# EAGLE design DorMouse (EAGLE 6.3)
DorMouse rocket flight-computer Schematic
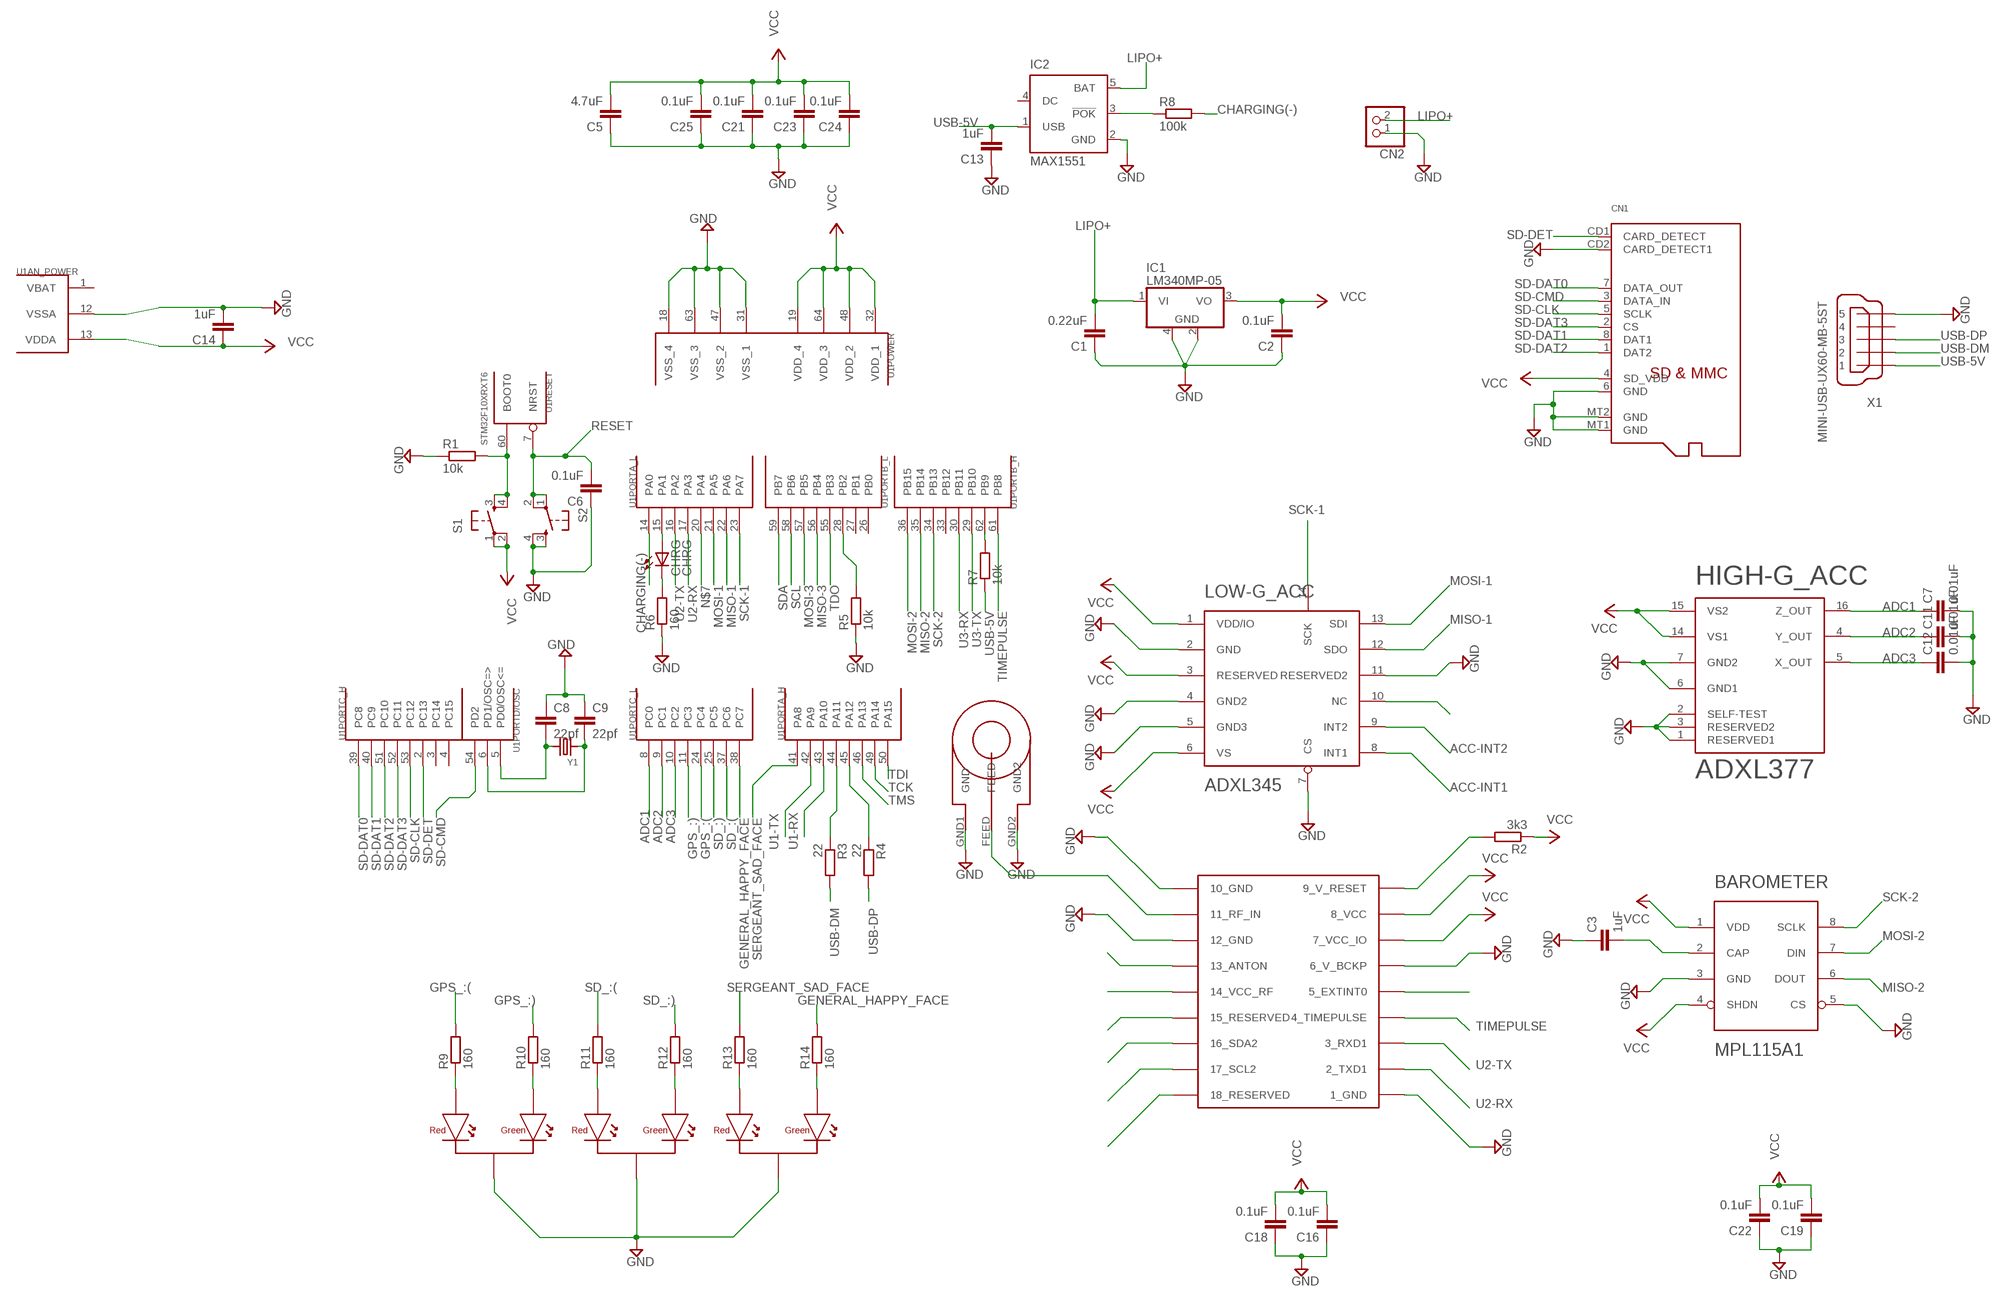
[diagram p0: schematic, sheet 1, part 1 of 2]
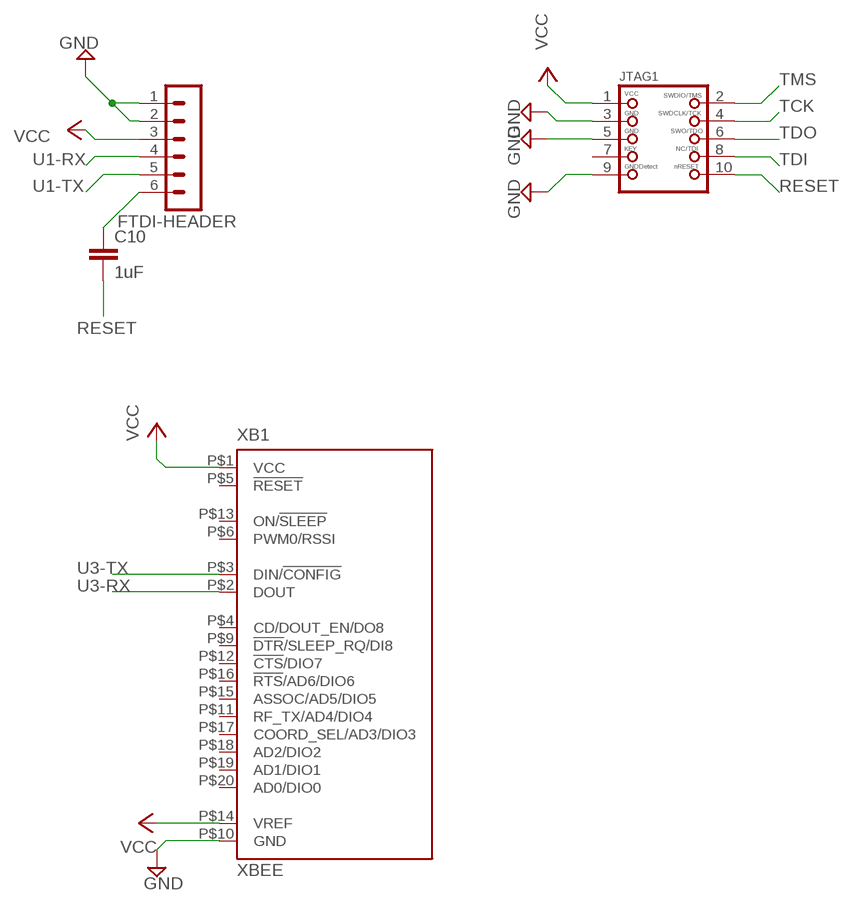
[diagram p1: schematic, sheet 1, part 2 of 2]

## Parts
BAROMETER  MPL115A1  [LGA-8]
C1  0.22uF  C-EUC0402  [C0402]
C2  0.1uF  C-EUC0402  [C0402]
C3  1uF  C-EUC0402  [C0402]
C5  4.7uF  C-EUC0402  [C0402]
C6  0.1uF  C-EUC0402  [C0402]
C7  0.01uF  C-EUC0402  [C0402]
C8  22pf  C-EUC0402  [C0402]
C9  22pf  C-EUC0402  [C0402]
C10  1uF  C-EUC0402  [C0402]
C11  0.01uF  C-EUC0402  [C0402]
C12  0.01uF  C-EUC0402  [C0402]
C13  1uF  C-EUC0402  [C0402]
C14  1uF  C-EUC0402  [C0402]
C16  0.1uF  C-EUC0402  [C0402]
C18  0.1uF  C-EUC0402  [C0402]
C19  0.1uF  C-EUC0402  [C0402]
C21  0.1uF  C-EUC0402  [C0402]
C22  0.1uF  C-EUC0402  [C0402]
C23  0.1uF  C-EUC0402  [C0402]
C24  0.1uF  C-EUC0402  [C0402]
C25  0.1uF  C-EUC0402  [C0402]
CHRG  CHRG  LEDCHIPLED_0603  [CHIPLED_0603]
CN1  MICROSD  [MICROSD]
CN2  JST_2PINSH2  [JSTSH2]
FTDI-HEADER  MA06-1  [MA06-1]
GENERAL  Status  RED-GREEN_LED  [SOT23]
GPS  UBLOX_MAX-6  [UBLOX_MAX-6]
GPS-LED  GPS  RED-GREEN_LED  [SOT23]
HIGH-G_ACC  ADXL377  [LFCSP-16]
IC1  LM340MP-05  [SOT223]
IC2  MAX1551  [SOT23-5L]
JTAG1  JTAG-CORTEXM3  [2X05_1.27MM_SMT]
LOW-G_ACC  ADXL345  [LGA-14]
R1  10k  R-EU_R0402  [R0402]
R2  3k3  R-EU_R0402  [R0402]
R3  22  R-EU_R0402  [R0402]
R4  22  R-EU_R0402  [R0402]
R5  10k  R-EU_R0402  [R0402]
R6  160  R-EU_R0402  [R0402]
R7  10k  R-EU_R0402  [R0402]
R8  100k  R-EU_R0402  [R0402]
R9  160  R-EU_R0402  [R0402]
R10  160  R-EU_R0402  [R0402]
R11  160  R-EU_R0402  [R0402]
R12  160  R-EU_R0402  [R0402]
R13  160  R-EU_R0402  [R0402]
R14  160  R-EU_R0402  [R0402]
S1  TAC_SWITCHSMD  [TACTILE_SWITCH_SMD]
S2  TAC_SWITCHSMD  [TACTILE_SWITCH_SMD]
SD-LED  SD-C  RED-GREEN_LED  [SOT23]
U1  STM32F10XRXT6  [TQFP64]
U$1  SARANTEL-SR1202  [SARANTEL-SR1202]
X1  MINI-USB-UX60-MB-5ST  [UX60-MB-5ST]
XB1  XBEE  [XBEE]
Y1  CRYSTALSMD  [HC49UP]

## Nets
ACC-INT1: LOW-G_ACC.8(INT1)
ACC-INT2: LOW-G_ACC.9(INT2)
ADC1: C7.1 HIGH-G_ACC.16(Z_OUT) U1.8(PORTC_L:PC0)
ADC2: C11.1 HIGH-G_ACC.4(Y_OUT) U1.9(PORTC_L:PC1)
ADC3: C12.1 HIGH-G_ACC.5(X_OUT) U1.10(PORTC_L:PC2)
BOOT1: R5.2 U1.28(PORTB_L:PB2)
CHARGING(-): R8.2 U1.14(PORTA_L:PA0)
GENERAL_HAPPY_FACE: R14.2 U1.38(PORTC_L:PC7)
GND: BAROMETER.3(GND) BAROMETER.5(CS) C1.1 C2.1 C3.1 C5.1 C6.1 C7.2 C8.1 C9.1 C11.2 C12.2 C13.1 C14.2 C16.1 C18.1 C19.1 C21.1 C22.1 C23.1 C24.1 C25.1 CN1.6(GND) CN1.CD2(CARD_DETECT1) CN1.MT1(GND) CN1.MT2(GND) CN2.1 FTDI-HEADER.1 FTDI-HEADER.2 GENERAL.3(CATHODE) GPS-LED.3(CATHODE) GPS.1_GND GPS.6_V_BCKP GPS.10_GND GPS.12_GND HIGH-G_ACC.1(RESERVED1) HIGH-G_ACC.2(SELF-TEST) HIGH-G_ACC.3(RESERVED2) HIGH-G_ACC.6(GND1) HIGH-G_ACC.7(GND2) IC1.2(GND1) IC1.4(GND) IC2.2(GND) JTAG1.3 JTAG1.5 JTAG1.9 LOW-G_ACC.2(GND) LOW-G_ACC.4(GND2) LOW-G_ACC.5(GND3) LOW-G_ACC.7(CS) LOW-G_ACC.11(RESERVED2) R1.1 R5.1 R6.1 S2.3 S2.4 SD-LED.3(CATHODE) U1.12(AN_POWER:VSSA) U1.18(POWER:VSS_4) U1.31(POWER:VSS_1) U1.47(POWER:VSS_2) U1.63(POWER:VSS_3) U$1.GND1(GND) U$1.GND2 X1.5 XB1.P$10(GND)
GPS_:(: R9.2 U1.24(PORTC_L:PC4)
GPS_:): R10.2 U1.11(PORTC_L:PC3)
LIPO+: C1.2 CN2.2 IC1.1(VI) IC2.5(BAT)
MISO-1: LOW-G_ACC.12(SDO) U1.22(PORTA_L:PA6)
MISO-2: BAROMETER.6(DOUT) U1.35(PORTB_H:PB14)
MISO-3: U1.56(PORTB_L:PB4)
MOSI-1: LOW-G_ACC.13(SDI) U1.21(PORTA_L:PA5)
MOSI-2: BAROMETER.7(DIN) U1.36(PORTB_H:PB15)
MOSI-3: U1.57(PORTB_L:PB5)
N$1: GPS.16_SDA2
N$2: R1.2 S1.3 S1.4 U1.60(RESET:BOOT0)
N$3: BAROMETER.2(CAP) C3.2
N$4: GPS.5_EXTINT0
N$5: R3.1 U1.44(PORTA_H:PA11)
N$6: C9.2 U1.6(PORTD/OSC:PD1/OSC=>) Y1.1
N$7: U1.20(PORTA_L:PA4)
N$8: R4.1 U1.45(PORTA_H:PA12)
N$9: CHRG.A U1.15(PORTA_L:PA1)
N$10: GPS.17_SCL2
N$11: LOW-G_ACC.10(NC)
N$12: CHRG.C R6.2
N$13: IC2.3(!POK) R8.1
N$14: C8.2 U1.5(PORTD/OSC:PD0/OSC<=) Y1.2
N$15: GPS.9_V_RESET R2.2
N$16: GPS.13_ANTON
N$17: GPS-LED.1(RED-ANODE) R9.1
N$18: GPS.11_RF_IN U$1.FEED
N$19: C10.1 FTDI-HEADER.6
N$20: GPS.15_RESERVED
N$21: R7.2 U1.62(PORTB_H:PB9)
N$23: GPS.18_RESERVED
N$24: GPS.14_VCC_RF
N$27: GPS-LED.2(GREEN-ANODE) R10.1
N$30: R11.1 SD-LED.1(RED-ANODE)
N$31: R12.1 SD-LED.2(GREEN-ANODE)
N$33: GENERAL.1(RED-ANODE) R13.1
N$34: GENERAL.2(GREEN-ANODE) R14.1
RESET: C6.2 C10.2 JTAG1.10 S2.1 S2.2 U1.7(RESET:NRST)
SCK-1: LOW-G_ACC.14(SCK) U1.23(PORTA_L:PA7)
SCK-2: BAROMETER.8(SCLK) U1.34(PORTB_H:PB13)
SCL: U1.58(PORTB_L:PB6)
SD-CLK: CN1.5(SCLK) U1.53(PORTC_H:PC12)
SD-CMD: CN1.3(DATA_IN) U1.54(PORTD/OSC:PD2)
SD-DAT0: CN1.7(DATA_OUT) U1.39(PORTC_H:PC8)
SD-DAT1: CN1.8(DAT1) U1.40(PORTC_H:PC9)
SD-DAT2: CN1.1(DAT2) U1.51(PORTC_H:PC10)
SD-DAT3: CN1.2(CS) U1.52(PORTC_H:PC11)
SD-DET: CN1.CD1(CARD_DETECT) U1.2(PORTC_H:PC13)
SD_:(: R11.2 U1.37(PORTC_L:PC6)
SD_:): R12.2 U1.25(PORTC_L:PC5)
SDA: U1.59(PORTB_L:PB7)
SERGEANT_SAD_FACE: R13.2 U1.41(PORTA_H:PA8)
TCK: JTAG1.4 U1.49(PORTA_H:PA14)
TDI: JTAG1.8 U1.50(PORTA_H:PA15)
TDO: JTAG1.6 U1.55(PORTB_L:PB3)
TIMEPULSE: GPS.4_TIMEPULSE U1.61(PORTB_H:PB8)
TMS: JTAG1.2 U1.46(PORTA_H:PA13)
U1-RX: FTDI-HEADER.4 U1.43(PORTA_H:PA10)
U1-TX: FTDI-HEADER.5 U1.42(PORTA_H:PA9)
U2-RX: GPS.2_TXD1 U1.17(PORTA_L:PA3)
U2-TX: GPS.3_RXD1 U1.16(PORTA_L:PA2)
U3-RX: U1.30(PORTB_H:PB11) XB1.P$2(DOUT)
U3-TX: U1.29(PORTB_H:PB10) XB1.P$3(DIN/!CONFIG)
USB-5V: C13.2 IC2.1(USB) R7.1 X1.1
USB-DM: R3.2 X1.2
USB-DP: R4.2 X1.3
VCC: BAROMETER.1(VDD) BAROMETER.4(SHDN) C2.2 C5.2 C14.1 C16.2 C18.2 C19.2 C21.2 C22.2 C23.2 C24.2 C25.2 CN1.4(SD_VDD) FTDI-HEADER.3 GPS.7_VCC_IO GPS.8_VCC HIGH-G_ACC.14(VS1) HIGH-G_ACC.15(VS2) IC1.3(VO) JTAG1.1 LOW-G_ACC.1(VDD/IO) LOW-G_ACC.3(RESERVED) LOW-G_ACC.6(VS) R2.1 S1.1 S1.2 U1.13(AN_POWER:VDDA) U1.19(POWER:VDD_4) U1.32(POWER:VDD_1) U1.48(POWER:VDD_2) U1.64(POWER:VDD_3) XB1.P$1(VCC) XB1.P$14(VREF)
Unconnected: IC2.4(DC) JTAG1.7 U1.3(PORTC_H:PC14) U1.4(PORTC_H:PC15) U1.26(PORTB_L:PB0) U1.27(PORTB_L:PB1) U1.33(PORTB_H:PB12) X1.4 XB1.P$4(CD/DOUT_EN/DO8) XB1.P$5(!RESET) XB1.P$6(PWM0/RSSI) XB1.P$9(!DTR!/SLEEP_RQ/DI8) XB1.P$11(RF_TX/AD4/DIO4) XB1.P$12(!CTS!/DIO7) XB1.P$13(ON/!SLEEP) XB1.P$15(ASSOC/AD5/DIO5) XB1.P$16(!RTS!/AD6/DIO6) XB1.P$17(COORD_SEL/AD3/DIO3) XB1.P$18(AD2/DIO2) XB1.P$19(AD1/DIO1) XB1.P$20(AD0/DIO0)

## Power pins joined to a net without a drawn wire
VBAT: U1.1(AN_POWER:VBAT)

## Library data of the parts
BAROMETER = DorMouse:MPL115A1
C1-C3 C5-C14 C16 C18 C19 C21-C25 = rcl:C-EU: CAPACITOR, European symbol
CHRG = led:LED: LED OSRAM: - CHIPLED LG R971, LG N971, LY N971, LG Q971, LY Q971, LO R971, LY R971 LH N974, LH R974 LS Q976, LO Q976, LY Q976 LO Q996 - Hyper CHIPLED LW Q18S LB Q993, LB Q99A, LB R99A - SideLED LS A670, LO A670, LY A670, LG A670, LP A670 LB A673, LV A673, LT A673, LW A673 LH A674 LY A675 LS A676, LA A676, LO A676, LY A676, LW A676 LS A679, LY A679, LG A679 - Hyper Micro SIDELED® LS Y876, LA Y876, LO Y876, LY Y876 LT Y87S - SmartLED LW L88C, LW L88S LB L89C, LB L89S, LG L890 LS L89K, LO L89K, LY L89K LS L896, LA L896, LO L896, LY L896 - TOPLED LS T670, LO T670, LY T670, LG T670, LP T670 LSG T670, LSP T670, LSY T670, LOP T670, LYG T670 LG T671, LOG T671, LSG T671 LB T673, LV T673, LT T673, LW T673 LH T674 LS T676, LA T676, LO T676, LY T676, LB T676, LH T676, LSB T676, LW T676 LB T67C, LV T67C, LT T67C, LS T67K, LO T67K, LY T67K, LW E67C LS E67B, LA E67B, LO E67B, LY E67B, LB E67C, LV E67C, LT E67C LW T67C LS T679, LY T679, LG T679 LS T770, LO T770, LY T770, LG T770, LP T770 LB T773, LV T773, LT T773, LW T773 LH T774 LS E675, LA E675, LY E675, LS T675 LS T776, LA T776, LO T776, LY T776, LB T776 LHGB T686 LT T68C, LB T68C - Hyper Mini TOPLED® LB M676 - Mini TOPLED Santana® LG M470 LS M47K, LO M47K, LY M47K Source: http://www.osram.convergy.de LUXEON: - LUMILED® LXK2-PW12-R00, LXK2-PW12-S00, LXK2-PW14-U00, LXK2-PW14-V00 LXK2-PM12-R00, LXK2-PM12-S00, LXK2-PM14-U00 LXK2-PE12-Q00, LXK2-PE12-R00, LXK2-PE12-S00, LXK2-PE14-T00, LXK2-PE14-U00 LXK2-PB12-K00, LXK2-PB12-L00, LXK2-PB12-M00, LXK2-PB14-N00, LXK2-PB14-P00, LXK2-PB14-Q00 LXK2-PR12-L00, LXK2-PR12-M00, LXK2-PR14-Q00, LXK2-PR14-R00 LXK2-PD12-Q00, LXK2-PD12-R00, LXK2-PD12-S00 LXK2-PH12-R00, LXK2-PH12-S00 LXK2-PL12-P00, LXK2-PL12-Q00, LXK2-PL12-R00 Source: www.luxeon.com KINGBRIGHT: KA-3528ASYC Source: www.kingbright.com
CN1 = microbuilder:MICROSD: MicroSD/Transflash Card Holder with SPI pinout 3M: 2908-05WB-MG 4UConnector: 19656 Footprint courtesy: Adafruit Industries
CN2 = microbuilder:JST_2PIN: JST 2-Pin Right-Angle Connector PH-Series - 4UConnector: 17311 SH-Series - 4UConnector: 07278
FTDI-HEADER = con-lstb:MA06-1: PIN HEADER; OC_FARNELL: unknown; OC_NEWARK: unknown
GENERAL GPS-LED SD-LED = DorMouse:RED-GREEN_LED
GPS = Ava:UBLOX_MAX-6: UBLOX MAX-6
HIGH-G_ACC = DorMouse:ADXL377
IC1 = DorMouse:LM340?-*: Positive VOLTAGE REGULATOR Source: http://cache.national.com/ds/LM/LM340.pdf
IC2 = maxim:MAX1551: Dual-Input USB/AC Adapter 1-Cell Li+ Battery Chargers Source: http://www.maxim-ic.com .. MAX1551-MAX1555.pdf; MF: MAXIM; MPN: MAX1551EZK-T; OC_FARNELL: 1628221; OC_NEWARK: 88H0599
JTAG1 = microbuilder:JTAG-CORTEXM3: Serial Wire (SW-DP) Connector This standard 0.05" 10-pin connector is for use with the Cortex M0/M3's native SWD (serial wire debugger) interface (SW-DP). Some boards support a 20-pin combined JTAG+SWD connector (SWJ-DP), such as the LPC1700 family, but many smaller devices only work with SWD which typically use the smaller 10-pin SW-DP connecter (the LPC1300 family, for example, only supports SWD). 2x05 1.27mm/0.05" Connector: This is the standard SMT connector defined by ARM for all Cortex devices, and should be used in most situations and for forward-compatibility since any new devices coming to market will likely use this connector. MOLEX 10 Pin 0.1" Connector: This 0.1" 10 pin connector has the same pin layout as the standard 0.05" connector, but is easier to work with if you are using standard jumper wires or custom cables to connect your SWD hardware. MOLEX 20 Pin 0.1" Connector: This 0.1" 20 pin connector is the same model used for ARM7/ARM9 JTAG debuggers, but is connected to match the pins on the Segger J-Link for ARM (which supports both JTAG and SWD debugging). See the following document from ARM for more information on Cortex M3 Debug Connectors: http://infocenter.arm.com/help/topic/com.arm.doc.faqs/attached/13634/cortex_debug_connectors.pdf And the following page for an overview with images of the different connector types: http://www.keil.com/peripherals/coresight/connectors.asp
LOW-G_ACC = Swallow:ADXL345
R1-R14 = rcl:R-EU_: RESISTOR, European symbol
S1 S2 = SparkFun:TAC_SWITCH: Momentary Switch Button commonly used for reset or general input. Spark Fun Electronics SKU : COM-00097
U1 = stm32:STM32F10XRXT6: STM32F101/103 64pin LQFP
U$1 = Ava:SARANTEL-SR1202: SARANTEL-SL1202 Author Anthony Stirk / http://ava.upuaut.net Data Sheet : http://docs-europe.electrocomponents.com/webdocs/0dbd/0900766b80dbde80.pdf
X1 = con-hirose:MINI-USB-: MINI USB Connector Source: http://www.hirose.co.jp/cataloge_hp/e24000019.pdf; OC_FARNELL: unknown; OC_NEWARK: unknown
XB1 = Swallow:XBEE: XBee (TM) /XBee-PRO(TM) OEM RF Modules Source: MaxStream, Inc. xbee_productmanual.pdf; MPN: XBP24-Z7UIT-004; OC_FARNELL: 1751799; OC_NEWARK: 34R5507
Y1 = microbuilder:CRYSTAL: Crystals HC49UP - Surface Mount Crystal 4.0MHz 18pF +/-30ppm Surface Mount Crystal [Digikey: 535-9857-1-ND] 12.0 MHz Surface Mount Crystal [Digikey: 535-9869-6-ND] 25.0 MHz Surface Mount Crystal [Digikey: 535-9078-1-ND] 2.5 x 2.0mm - MEMs SMT Crystal 16.0 MHz 10pF 20ppm 2.5 x 2.0mm Crystal [Digikey -40-85°C: 535-10923-1-ND] 3.2 x 2.5mm - MEMs SMT Crystal 12.0 MHz 8pF 15ppm 3.2 x 2.5mm Crystal [Digikey: -10-70°C: 644-1047-1-ND -40-125°C: 644-1128-1-ND] 16.0 MHz 8pF 15ppm 3.2 x 2.5mm Crystal [Digikey: -10-70°C: 644-1049-1-ND -40-125°C: 644-1129-2-ND] 16.0 MHz 10pF 10ppm 3.2 x 2.5mm Crystal [Digikey: 644-1100-1-ND] 27.12 MHz 18pF 30ppm 3.2 x 2.5mm Crystal [Digikey: 887-1424-1-ND] 27.12MHz 10pF 10ppm 3.2 x 2.5mm Crystal [Digikey: 887-1329-1-ND] 4.9 x 1.8mm - MEMs SMT Crystal 32.768 KHz 12.5pF 20ppm 4.9 x 1.8mm Crystal [Digikey: SE2415CT-ND] 8.0 x 3.8mm - Surface Mount Crystal 32.768kHz 12.5pF 20ppm -40°C-85°C [Digikey: 535-9166-2-ND] Cylinder 32.768KHz Cylinder Crystal (2x6mm body) [Ex. Digikey: 300-8341-2-ND]

## Board
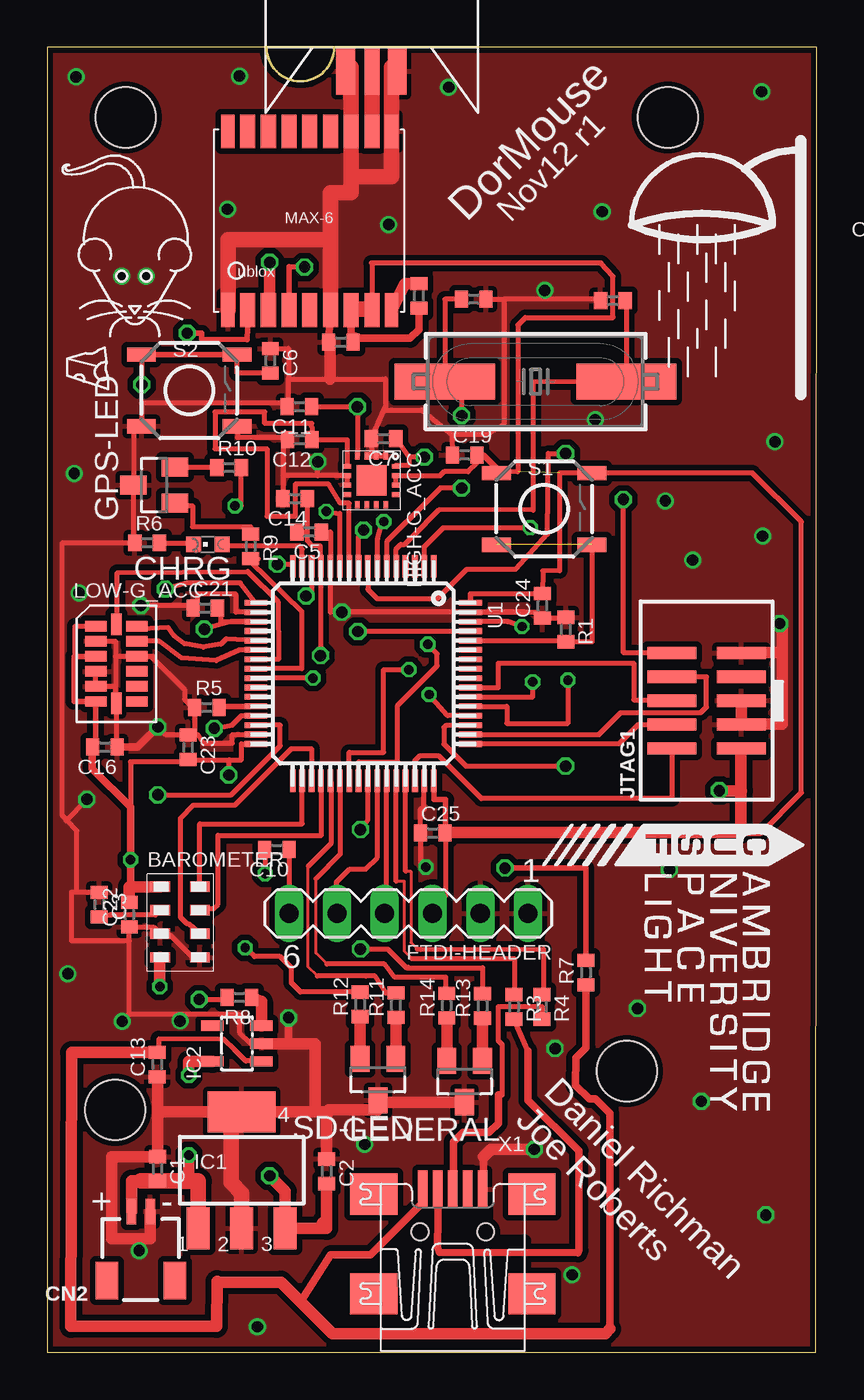
[diagram p2: board, top side]
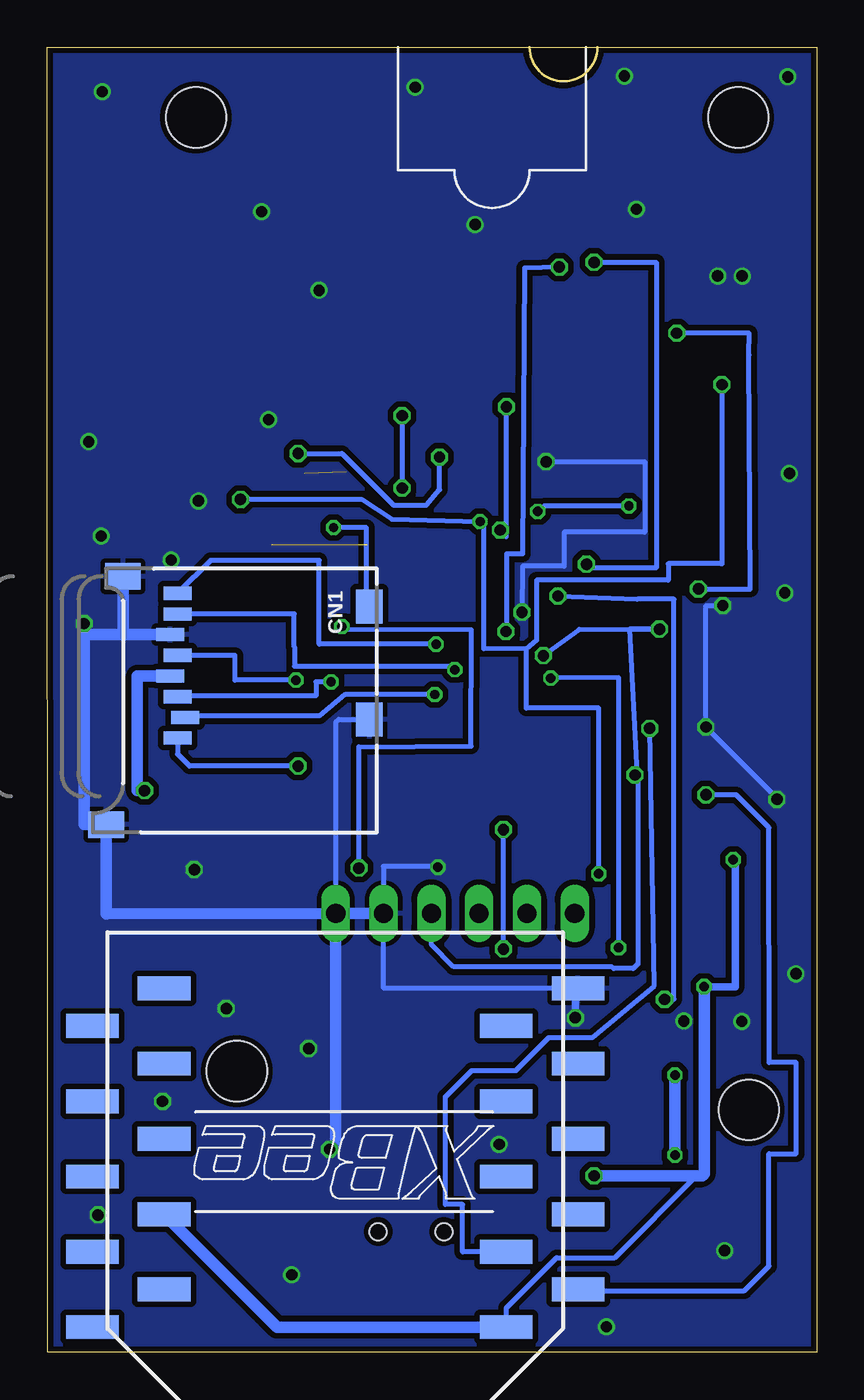
[diagram p3: board, bottom side, seen from below]

Size 40.92 x 69.38 mm. Coordinates in mm from the lower left corner, seen from the top.
Outline: 0,0 40.87,0 40.92,69.38 0,69.38 0,0
Copper layers (1*16): Top 0.035mm / dielectric 1.5mm / Bottom 0.035mm
Design rules "Fusion_eagle_rule_v1.1": minimum track width 6mil, minimum drill 12mil, track to track 6mil, track to pad 6mil, pad to pad 6mil, via to via 6mil, smd to smd 0mil, copper to edge 10mil, drill to drill 10mil, minimum pad ring 10mil, minimum via ring 6mil, stop-mask expansion 2mil, vias tented up to drill 100mil, thermal gap 10mil
Holes 3.2 mm at 33,65.64 4.18,65.64 3.62,12.89 30.83,14.95

### Footprints (pad centres in the part's own frame; a part is rotated, then mirrored left to right if it is on the bottom)
LGA-8 = smd 1.05 x 0.55: 1 0.35,4; 2 0.35,2.75; 3 0.35,1.5; 4 0.35,0.25; 5 2.45,0.25; 6 2.45,1.5; 7 2.45,2.75; 8 2.45,4
C0402 = smd 0.7 x 0.9: 1 -0.65,0; 2 0.65,0
CHIPLED_0603 = smd 0.8 x 0.8: A 0,-0.75; C 0,0.75
MICROSD = smd 0.7 x 1.5: 1 9,-10.64; 2 7.9,-10.24; 3 6.8,-10.64; 4 5.7,-11.04; 5 4.6,-10.64; 6 3.5,-11.04; 7 2.4,-10.64; 8 1.3,-10.64 | smd 1.8 x 1.4: CD1 2,-0.44; CD2 8,-0.44 | smd 1.4 x 1.9: MT1 0.4,-13.54; MT2 13.6,-14.44
JSTSH2 = smd 0.5 x 1.35: 1 -0.5,-2.55; 2 0.5,-2.55 | smd 1.2 x 2: NC1 -1.8,1.125; NC2 1.8,1.125
MA06-1 = drill 1.016 long: 1 -6.35,0; 2 -3.81,0; 3 -1.27,0; 4 1.27,0; 5 3.81,0; 6 6.35,0
SOT23 = smd 1 x 1.4: 1 -0.95,-1.1; 2 0.95,-1.1; 3 0,1.1
UBLOX_MAX-6 = smd 1.8 x 0.7: 1_GND 4.95,-4.4; 9_V_RESET 4.95,4.3; 10_GND -4.55,4.3; 18_RESERVED -4.55,-4.4 | smd 1.8 x 0.8: 2_TXD1 4.95,-3.35; 3_RXD1 4.95,-2.25; 4_TIMEPULSE 4.95,-1.15; 5_EXTINT0 4.95,-0.05; 6_V_BCKP 4.95,1.05; 7_VCC_IO 4.95,2.15; 8_VCC 4.95,3.25; 11_RF_IN -4.55,3.25; 12_GND -4.55,2.15; 13_ANTON -4.55,1.05; 14_VCC_RF -4.55,-0.05; 15_RESERVED -4.55,-1.15; 16_SDA2 -4.55,-2.25; 17_SCL2 -4.55,-3.35
LFCSP-16 = smd 0.4 x 0.25: 1 -1.3,0.75; 2 -1.3,0.25; 3 -1.3,-0.25; 4 -1.3,-0.75; 9 1.3,-0.75; 10 1.3,-0.25; 11 1.3,0.25; 12 1.3,0.75 | smd 0.25 x 0.4: 5 -0.75,-1.3; 6 -0.25,-1.3; 7 0.25,-1.3; 8 0.75,-1.3; 13 0.75,1.3; 14 0.25,1.3; 15 -0.25,1.3; 16 -0.75,1.3 | smd 1.6 x 1.6: NC 0,0
SOT223 = smd 1.219 x 2.235: 1 -2.311,-3.099; 2 0,-3.099; 3 2.311,-3.099 | smd 3.6 x 2.2: 4 0,3.099
SOT23-5L = smd 0.55 x 1.2: 1 -0.95,-1.3; 2 0,-1.3; 3 0.95,-1.3; 4 0.95,1.3; 5 -0.95,1.3
2X05_1.27MM_SMT = smd 0.65 x 2.6: 1 -2.54,-1.85; 2 -2.54,1.85; 3 -1.27,-1.85; 4 -1.27,1.85; 5 0,-1.85; 6 0,1.85; 7 1.27,-1.85; 8 1.27,1.85; 9 2.54,-1.85; 10 2.54,1.85
LGA-14 = smd 1.145 x 0.55: 1 -1.2,1.1; 2 -1.2,0.3; 3 -1.2,-0.5; 4 -1.2,-1.3; 5 -1.2,-2.1; 6 -1.2,-2.9; 8 1,-2.9; 9 1,-2.1; 10 1,-1.3; 11 1,-0.5; 12 1,0.3; 13 0.995,1.1 | smd 0.55 x 1.145: 7 -0.1,-3; 14 -0.1,1.2
R0402 = smd 0.7 x 0.9: 1 -0.65,0; 2 0.65,0
TACTILE_SWITCH_SMD = smd 1.524 x 0.762: 1 -2.54,1.905; 2 2.54,1.905; 3 -2.54,-1.905; 4 2.54,-1.905
TQFP64 = smd 1.2 x 0.3: 1 -5.7,3.75; 2 -5.7,3.25; 3 -5.7,2.75; 4 -5.7,2.25; 5 -5.7,1.75; 6 -5.7,1.25; 7 -5.7,0.75; 8 -5.7,0.25; 9 -5.7,-0.25; 10 -5.7,-0.75; 11 -5.7,-1.25; 12 -5.7,-1.75; 13 -5.7,-2.25; 14 -5.7,-2.75; 15 -5.7,-3.25; 16 -5.7,-3.75; 33 5.7,-3.75; 34 5.7,-3.25; 35 5.7,-2.75; 36 5.7,-2.25; 37 5.7,-1.75; 38 5.7,-1.25; 39 5.7,-0.75; 40 5.7,-0.25; 41 5.7,0.25; 42 5.7,0.75; 43 5.7,1.25; 44 5.7,1.75; 45 5.7,2.25; 46 5.7,2.75; 47 5.7,3.25; 48 5.7,3.75 | smd 0.3 x 1.2: 17 -3.75,-5.7; 18 -3.25,-5.7; 19 -2.75,-5.7; 20 -2.25,-5.7; 21 -1.75,-5.7; 22 -1.25,-5.7; 23 -0.75,-5.7; 24 -0.25,-5.7; 25 0.25,-5.7; 26 0.75,-5.7; 27 1.25,-5.7; 28 1.75,-5.7; 29 2.25,-5.7; 30 2.75,-5.7; 31 3.25,-5.7; 32 3.75,-5.7; 49 3.75,5.7; 50 3.25,5.7; 51 2.75,5.7; 52 2.25,5.7; 53 1.75,5.7; 54 1.25,5.7; 55 0.75,5.7; 56 0.25,5.7; 57 -0.25,5.7; 58 -0.75,5.7; 59 -1.25,5.7; 60 -1.75,5.7; 61 -2.25,5.7; 62 -2.75,5.7; 63 -3.25,5.7; 64 -3.75,5.7
SARANTEL-SR1202 = smd 2.5 x 0.8: FEED 0,0 | smd 2.5 x 1: GND1 0,1.4; GND2 0,-1.35
UX60-MB-5ST = smd 2 x 0.5: 1 2.25,1.6; 2 2.25,0.8; 3 2.25,0; 4 2.25,-0.8; 5 2.25,-1.6 | smd 2.2 x 2.5: M1 -3.3,-4.2; M2 -3.3,4.2; M3 2,4.2; M4 2,-4.2 | hole 0.9: 0,-1.75; 0,1.75
XBEE = smd 2.8 x 1.27: P$1 -9.092,9; P$2 -12.908,7; P$3 -9.092,5; P$4 -12.908,3; P$5 -9.092,1; P$6 -12.908,-1; P$7 -9.092,-3; P$8 -12.908,-5; P$9 -9.092,-7; P$10 -12.908,-9; P$11 12.908,9; P$12 9.092,7; P$13 12.908,5; P$14 9.092,3; P$15 12.908,1; P$16 9.092,-1; P$17 12.908,-3; P$18 9.092,-5; P$19 12.908,-7; P$20 9.092,-9
HC49UP = smd 5.334 x 1.93: 1 -4.826,0; 2 4.826,0

### Placement (x,y rotation side)
BAROMETER  5.67,20.75 0 top
C1  5.88,9.76 270 top
C2  14.87,9.63 270 top
C3  2.78,23.8 270 top
C5  13.93,43.61 180 top
C6  11.87,52.7 270 top
C7  17.89,48.56 180 top
C8  30.08,55.9 0 top
C9  22.68,55.98 180 top
C10  12.21,26.73 180 top
C11  13.41,50.26 180 top
C12  13.43,48.51 180 top
C13  5.86,15.3 90 top
C14  13.19,45.38 180 top
C16  3.08,32.17 180 top
C18  15.62,53.69 0 top
C19  22.2,47.7 0 top
C21  8.41,39.56 0 top
C22  4.38,23.26 90 top
C23  7.5,32.17 270 top
C24  26.33,39.68 90 top
C25  20.51,27.6 0 top
CHRG  8.55,42.95 90 top
CN1  23.34,41.65 270 bottom
CN2  4.99,4.94 180 top
FTDI-HEADER  19.22,23.33 180 top
GENERAL  22.2,14.4 180 top
GPS  14.02,60.34 270 top
GPS-LED  5.7,46.1 90 top
HIGH-G_ACC  17.25,46.35 270 top
IC1  10.35,9.69 0 top
IC2  10.1,16.42 90 top
JTAG1  35.06,34.64 90 top
LOW-G_ACC  3.79,37.5 0 top
R1  27.58,38.42 270 top
R2  19.77,56.16 90 top
R3  24.83,18.37 270 top
R4  26.31,18.37 270 top
R5  8.5,34.28 0 top
R6  5.32,43.03 0 top
R7  28.65,20.19 90 top
R8  10.23,18.87 180 top
R9  10.83,42.84 270 top
R10  9.68,47.03 0 top
R11  18.55,18.46 90 top
R12  16.65,18.5 90 top
R13  23.15,18.42 90 top
R14  21.25,18.44 90 top
S1  26.43,44.83 0 top
S2  7.56,51.13 0 top
SD-LED  17.59,14.5 180 top
U1  16.81,36.09 270 top
U$1  17.27,68.09 90 top
U$2  [SHOWER]  34.56,61.9 0 top
U$3  [DORMOUSE]  4.58,58.23 0 top
U$4  [CUSF_LOGO]  26.26,28.23 270 top
X1  21.57,6.42 90 top
XB1  25.6,10.35 180 bottom
Y1  25.97,51.6 0 top

### Tracks (layer width: path | path; a pad name or v marks a point on that pad's centre or on a via)
ADC1  (via drill 0.6)
  Top 0.254: 17.09,41.79 U1.8 17.06,40.55 17.55,40.06 20.75,40.06 22.32,41.63 24.92,41.63 26.61,43.49 26.65,47.78 v27.57,47.78 | C7.1 19.24,47.6 | 19.24,47.6 19.24,47.14 18.55,47.14 HIGH-G_ACC.16 | v20.06,47.59 19.24,47.6
  Bottom 0.254: v27.57,47.78 25.24,47.78 22.49,45.03 20.76,45.03 20.05,45.85 v20.05,47.59 v20.06,47.59
ADC2  (via drill 0.6)
  Top 0.254: C11.1 v16.5,50.26 HIGH-G_ACC.4 | U1.9 16.55,43.35 v16.83,43.71
  Bottom 0.254: v16.83,43.71 16.5,43.36 v16.5,50.26
ADC3
  Top 0.254: HIGH-G_ACC.5 15.95,48.51 C12.1 14.08,49.19 14.07,49.19 14.07,49.37 11.58,49.37 11.58,49.99 8.92,49.99 8.92,48.03 11.69,48.03 11.69,44.43 13.19,44.43 13.19,46.14 14.97,46.14 15.57,45.15 16.06,45.14 U1.10 16.09,41.79
BOOT1
  Top 0.305: U1.28 9.15,34.34 R5.2
CHARGING(-)  (via drill 0.6)
  Top 0.254: U1.14 14.06,40.41 v13.76,40.2 | v8.09,18.77 9.58,18.77 R8.2
  Bottom 0.254: v13.76,40.2 9.54,40.04 7.59,40.04 7.59,18.77 v8.09,18.77
GENERAL_HAPPY_FACE
  Top 0.15: 14.88,20.64 14.29,21.23 14.29,25.19
  Top 0.254: R14.2 21.2,19.09 21.2,19.94 18.47,19.94 18.25,20.23 17.93,20.64 14.88,20.64 | 15.59,30.36 15.59,30.02 | 15.59,30.02 15.59,26.49 14.29,25.19 | U1.38 15.56,30.02 15.59,30.02
GND  (via drill 0.5, 0.6)
  Top 0.254: R5.1 7.85,32.84 | 7.85,32.84 7.85,32.82 C23.1 6.31,32.82 v5.89,33.24 | 7.85,32.84 8.02,32.83 8.29,32.39 9.84,32.39 9.84,32.84 U1.31 | U1.47 20.05,28.88 19.86,28.89 C25.1 19.86,25.79 v20.14,25.79 | C3.1 1.59,24.45 | 1.59,24.45 1.29,24.45 1.29,21.89 4.34,21.89 | 4.34,21.89 4.38,21.89 C22.1 5.66,22.61 BAROMETER.3 6.02,22.19 6.54,22.19 7.73,21 BAROMETER.5 | C16.1 3.69,32.17 LOW-G_ACC.7 3.64,34.5 3.64,35.4 | 3.64,35.4 LOW-G_ACC.5 LOW-G_ACC.4 | 3.64,37 LOW-G_ACC.11 5.39,37 | 3.64,37 3.64,35.4 | LOW-G_ACC.2 3.64,37.8 3.64,37 | C8.1 29.43,55.94 29.49,55.94 29.49,55.98 24.28,55.98 | 4.14,43.03 R6.1 4.6,43.03 GPS-LED.3 4.6,49.22 S2.3 5.02,50.45 12.76,50.45 C11.2 12.84,50.26 12.84,51.74 | 4.14,43.03 3.84,43.03 | 17.24,47.65 C7.2 17.99,50.26 | HIGH-G_ACC.1 HIGH-G_ACC.2 17.24,47.65 | HIGH-G_ACC.3 17.24,47.65 | 21.54,48.78 19.93,50.09 17.99,50.09 17.99,50.26 | HIGH-G_ACC.6 HIGH-G_ACC.7 | 12.84,51.74 15.05,51.74 17.99,51.74 17.99,50.26 | C9.1 24.28,55.98 | 24.28,55.98 24.28,49.33 23.41,48.78 21.54,48.78 | U1.12 15.09,41.79 | 1.59,24.45 1.59,27.74 1.06,28.27 | 1.06,28.27 0.82,28.53 0.82,43.04 4.13,43.04 4.14,43.03 | C5.1 15.06,43.61 U1.12 | 4.34,21.89 4.34,17.99 4.35,17.99 4.36,17.99 10.14,17.99 10.22,17.91 10.22,17.02 10.79,16.45 11.4,16.45 IC2.2 11.43,16.39 11.45,16.39 | C6.1 12.84,53.35 12.84,51.74 | 12.54,46.6 12.54,48.51 C12.2 12.78,48.64 10.12,48.64 10.12,49.22 S2.4 | 12.54,46.6 C14.2 | HIGH-G_ACC.6 12.54,46.6 | v4.99,39.7 7.74,39.7 C21.1 7.81,39.5 7.95,39.55 8.01,40.31 10.04,40.3 10.04,39.34 U1.18 | v2.12,29.4 1.01,28.27 1.06,28.27 | HIGH-G_ACC.6 14.39,46.6 v14.39,47.34 | U1.12 15.06,39.34 v15.67,39.34 U1.63
  Top 0.254: 25.43,39.34 U1.63 | 5.64,37 5.39,37 | 5.39,37 4.71,36.99 | R1.1 27.58,39.03 C24.1 26.02,39.34 U1.63 | 21.54,48.78 C19.1 | 7.79,34.23 7.31,34.71 7.31,35.23 5.54,37 5.39,37 | 5.39,37
  Top 0.305: 14.24,16.39 13.03,16.39
  Top 0.406: C18.1 GPS.6_V_BCKP | v12.84,17.79 12.84,16.39 | C16.1 4.82,32.17 v5.89,33.24 | X1.5 23.2,8.7 23.2,10.4
  Top 0.61: 5.88,12.79 C1.1 3.44,10.41 3.44,6.04 5.49,6.04 CN2.1 | 5.88,12.79 IC1.4 14.24,12.79 | C2.1 14.87,11.54 | 14.87,11.54 14.87,12.79 | 14.87,12.79 14.24,12.79 | 11.45,16.39 12.84,16.39 14.24,16.39 14.24,12.79 | GENERAL.3 17.59,13.3 SD-LED.3 17.59,12.9 14.98,12.9 14.87,12.79 | JTAG1.5 36.91,33.39 | 36.91,33.39 JTAG1.3 | 5.88,12.79 5.88,14.65 C13.1 | 14.87,11.54 14.86,11.13 14.85,11.65 | 36.91,33.39 39.09,33.39 39.09,37.19 | 39.09,37.19 JTAG1.9 | v38.95,38.74 39.09,38.74 39.09,37.19 | C18.1 15.05,53.88 15.05,51.74 | 23.2,10.4 23.6,10.8 v25.9,10.8
  Top 0.813: U$1.GND1 16.17,68.29 GPS.12_GND 16.17,62.49 | U$1.GND2 18.32,68.29 GPS.10_GND 18.32,62.49 16.17,62.49 | 16.17,62.49 16.17,61.64 15.07,61.64 15.07,59.14 | 15.07,59.14 GPS.6_V_BCKP | GPS.1_GND 9.62,59.14 15.07,59.14 | IC1.2 10.35,8.46 9.78,9.03 9.78,12.22 IC1.4
  Bottom 0.254: v20.14,25.79 20.14,25.84 23.04,25.84 FTDI-HEADER.2 23.03,19.35 XB1.P$10 | FTDI-HEADER.1 25.57,33.5 25.42,33.65 CN1.CD2 | v4.99,39.7 5.89,39.69 v5.89,33.24 2.12,29.47 v2.12,29.4 | v14.39,47.34 9.14,47.34 9.14,43.59 13.44,43.59 13.44,41.79 15.64,41.79 v15.67,39.34
  Bottom 0.406: XB1.P$10 12.84,19.2 v12.84,17.79
  Bottom 0.61: FTDI-HEADER.1 37.75,23.31 37.78,23.31 CN1.MT2 38.95,28.05 v38.95,38.74 38.95,38.15 36.88,38.15 | FTDI-HEADER.1 FTDI-HEADER.2 | CN1.6 36.88,38.15 | 36.88,38.15 CN1.MT1 | v25.9,10.8 25.57,11.13 FTDI-HEADER.1
  other vias: 1.54,67.79 10.23,67.84 21.35,67.25 37.99,67.01 29.51,60.63 26.46,56.45 18.16,59.95 9.59,60.76 29.14,49.58 38.7,48.4 32.87,45.26 38.04,43.39 34.32,42.12 1.45,46.72 1.7,40.37 1.11,20.13 3.99,17.6 7.07,17.61 4.9,5.41 11.18,1.37 27.91,4.13 16.89,11.06 27.01,16.15 31.39,18.28 38.21,7.31 34.78,13.35 33.09,25.66 3.97,57.21 5.27,57.21
  pour Bottom (isolate 0.305): -14.17,-4.87 52.36,-7.3 55.78,71.4 40.72,73.74 -13.95,73.99
  pour Top (isolate 0.305): -11.5,-4.56 47.16,-5.76 50.43,73.74 -11.74,72.82
GPS_:(
  Top 0.254: 11.24,42.19 R9.2 10.83,42 13.54,39.39 13.54,36.34 U1.24
GPS_:)  (via drill 0.5)
  Top 0.254: v14.84,44.7 15.56,44.59 U1.11 | v9.99,44.99 10.33,44.99 R10.2
  Bottom 0.254: v9.99,44.99 14.49,44.99 v14.84,44.7
LIPO+  (via drill 0.5)
  Top 0.61: IC2.5 7.54,15.47 v7.54,14.74 | v7.54,10.49 7.54,9.11 | CN2.2 4.49,9.11 5.34,9.11
  Top 0.813: 4.99,9.11 5.34,9.11 C1.2 7.54,9.11 8.04,9.11 8.04,9.09 | IC1.1 8.04,9.09 | 8.04,9.09 7.14,9.09
  Bottom 0.61: v7.54,14.74 v7.54,10.49
MISO-1
  Top 0.254: U1.22 10.24,37.34 9,36.77 7.15,36.91 5.96,37.8 LOW-G_ACC.12
MISO-2
  Top 0.254: BAROMETER.6 7.76,22.61 7.6,22.72 7.42,22.79 7.09,23.12 7.09,28.39 7.79,29.09 9.99,29.09 12.99,32.09 14.06,32.09 U1.35
MOSI-1
  Top 0.254: 4.92,38.64 4.83,38.55 LOW-G_ACC.13 5,38.45 6.44,38.52 6.77,38.08 7.3,37.67 8.3,37.49 9.25,37.64 9.53,37.92 U1.21
MOSI-2
  Top 0.254: BAROMETER.7 8.12,23.59 8.86,23.59 9.09,23.82 9.09,27.49 14.59,27.49 14.59,30.39 U1.36
N$2  (1 unrouted)
  Top 0.254: U1.60 27.58,37.84 R1.2 28.97,37.77 S1.4
N$3
  Top 0.254: BAROMETER.2 5.76,23.25 3.38,23.25
  Top 0.305: 3.38,23.25 2.74,23.19 C3.2
N$5
  Top 0.15: 18.56,25.04 18.99,25.04 18.99,21.34 19.39,20.94
  Top 0.254: R3.1 24.74,19.02 | R3.1 24.79,19.02 | 18.56,25.04 U1.44 | 19.39,20.94 24.84,20.94 R3.1
N$6  (via drill 0.6)
  Top 0.254: C9.2 21.14,55.98 Y1.1 22.04,51.6 v22.04,49.79 | v22.04,45.94 20.91,45.94 20.19,45.22 18.06,43.09 U1.6
  Bottom 0.254: v22.04,49.79 v22.04,45.94
N$8
  Top 0.15: 19.06,25.57 19.34,25.57 19.34,21.79 19.69,21.44
  Top 0.254: 19.06,25.57 U1.45 | 19.69,21.44 19.87,21.43 26.39,21.44 26.39,19.09 R4.1
N$9
  Top 0.254: 9.3,42.99 CHRG.A 9.3,42.86 13.45,42.86 13.56,42.69 U1.15 13.59,41.79
N$12
  Top 0.254: R6.2 7.8,43.03 CHRG.C
N$13
  Top 0.61: R8.1 11.4,18.65 IC2.3
N$14
  Top 0.254: C8.2 30.8,55.9 Y1.2 25.84,51.58 25.84,44.77 20.84,44.79 19.45,43.4 18.99,42.94 18.8,42.94 18.56,42.7 U1.5
N$15
  Top 0.61: R2.2 19.03,56.81 GPS.9_V_RESET
N$17
  Top 0.254: 6.74,45 6.84,45 | 6.84,45 7.74,45 7.74,43.89 10.83,43.89 R9.1 | GPS-LED.1 6.84,45.11 6.84,45
N$18
  Top 0.813: GPS.11_RF_IN U$1.FEED
N$19
  Top 0.254: C10.1 FTDI-HEADER.6
N$21  (via drill 0.5, 0.6)
  Top 0.254: v25.25,38.58 24.49,38.84 U1.62 | R7.2
  Top 0.305: v24.34,25.74 28.64,25.74 R7.2
  Bottom 0.254: v25.25,38.58 25.22,38.43 18.36,38.4 18.38,32.22 24.34,32.19 v24.34,25.74
N$27
  Top 0.254: GPS-LED.2 9.03,47.05 R10.1
N$30
  Top 0.61: R11.1 SD-LED.1
N$31
  Top 0.61: R12.1 SD-LED.2
N$33
  Top 0.61: R13.1 GENERAL.1
N$34
  Top 0.61: R14.1 GENERAL.2
RESET  (via drill 0.5, 0.6)
  Top 0.254: 17.54,41.79 U1.7 17.56,42.74 17.57,43.24 17.87,44.29 v17.9,44.16 | C10.2 11.59,26.73 v11.59,25.44 | JTAG1.10 30.64,37.18 v30.64,45.34 | C6.2 10.1,52.05 S2.2 | S2.1 5.02,51.44 v5.04,51.44
  Top 0.305: S2.1 S2.2
  Bottom 0.254: v11.59,25.44 11.59,34.24 15.44,34.24 15.43,37.39 | 15.43,37.39 17.7,37.4 17.69,44.29 v17.9,44.16 22.59,44.28 24.21,45.35 v30.64,45.35 v30.64,45.34 | v5.04,51.44 5.04,41.92 5.09,41.92 7.9,41.92 7.9,41.04 14.89,41.04 14.89,37.84 15.43,37.39
SCK-1
  Top 0.254: LOW-G_ACC.14 3.74,38.7 3.74,41.45 10.67,41.51 12.28,39.9 12.3,36.84 U1.23
SCK-2
  Top 0.254: BAROMETER.8 8.12,28.09 13.56,28.1 U1.34
SD-CLK  (via drill 0.5)
  Top 0.254: U1.53 24.44,34.34 24.44,33.44 27.68,33.43 v27.69,35.73
  Bottom 0.254: 33.98,37.15 CN1.5 30.93,37.05 30.93,35.73 v27.69,35.73
SD-CMD  (via drill 0.5)
  Top 0.254: U1.54 25.82,34.84 v25.82,35.64
  Bottom 0.254: CN1.3 33.98,34.9 29.08,34.9 29.08,34.89 26.62,34.89 26.62,35.64 v25.82,35.64
SD-DAT0  (via drill 0.5)
  Top 0.254: U1.39 16.06,31.89 17.89,31.89 17.89,36.29 v19.24,36.29
  Bottom 0.254: CN1.7 27.78,39.25 27.78,37.5 27.77,37.5 27.77,36.47 19.24,36.47 v19.24,36.29
SD-DAT1  (via drill 0.5)
  Top 0.254: U1.40 16.56,31.39 18.64,31.39 18.64,34.39 20.74,36.49 20.74,37.14 v20.24,37.64
  Bottom 0.254: CN1.8 32.23,42.1 26.45,42.1 26.45,37.64 v20.24,37.64
SD-DAT2  (via drill 0.6)
  Top 0.254: U1.51 22.49,33.32 21.2,33.32 21.1,33.22 21.1,32.33 22.27,31.16 v27.57,31.16
  Bottom 0.254: CN1.1 33.98,31.8 33.34,31.16 v27.57,31.16
SD-DAT3  (via drill 0.5)
  Top 0.254: U1.52 21.29,33.84 v20.31,34.97
  Bottom 0.254: v20.31,34.97 25.09,34.96 26.44,33.83 33.5,33.83 CN1.2
SD-DET  (via drill 0.5)
  Top 0.254: U1.2 20.06,42.83 21.07,43.84 v25.69,43.84
  Bottom 0.254: CN1.CD1 23.78,39.7 23.94,39.7 23.94,43.84 v25.69,43.84
SD_:(
  Top 0.15: 14.38,20 13.89,20.49 13.89,25.84
  Top 0.254: 18.5,19.11 R11.2 18.01,19.11 17.43,20 16.93,20 14.38,20 | 15.09,30.36 15.09,30.28 | 15.09,30.28 15.09,27.04 13.89,25.84 | U1.37 15.06,30.28 15.09,30.28
SD_:)  (via drill 0.5)
  Top 0.254: v10.53,21.5 v10.53,21.51 11.03,21.04 12.38,21.04 12.99,20.43 12.99,19.64 13.48,19.15 R12.2 16.59,19.15 | v14.14,35.84 U1.25
  Bottom 0.254: v10.53,21.51 10.53,35.86 v14.14,35.84
SERGEANT_SAD_FACE  (via drill 0.6)
  Top 0.254: v16.66,27.79 17.06,28.31 U1.41 | v16.66,21.44 18.11,21.44 19.1,20.45 19.19,20.45 | 19.19,20.45 23.15,20.44 R13.2 | 19.19,20.45 19.19,20.47 19.15,20.47
  Bottom 0.254: v16.66,21.44 v16.66,27.79
TCK
  Top 0.254: JTAG1.4 33.19,33.35 31.4,33.35 30.39,32.34 U1.49
TDI
  Top 0.254: U1.50 29.34,32.84 30.5,34 34.75,34 35.05,34.3 35.05,35.9 35.04,35.91 JTAG1.8
TDO
  Top 0.254: U1.55 23.99,35.34 23.99,36.64 31.19,36.64 31.19,34.69 33.21,34.69 JTAG1.6
TIMEPULSE  (via drill 0.6)
  Top 0.254: v16.52,38.32 16.54,38.34 U1.61
  Top 0.305: v13.69,57.69 12.87,57.71 GPS.4_TIMEPULSE
  Bottom 0.254: v13.69,57.69 15.54,57.64 15.64,42.44 16.49,42.44 16.49,39.19 v16.52,38.32
TMS
  Top 0.254: JTAG1.2 33.21,29.44 23.09,29.44 20.84,31.69 19.79,31.69 19.54,31.44 19.54,30.41 U1.46
U1-RX
  Top 0.254: FTDI-HEADER.4 18.06,23.33 U1.43
U1-TX
  Top 0.254: FTDI-HEADER.5 15.39,23.33 15.39,25 16.08,25.69 16.94,25.69 17.56,26.31 U1.42
U2-RX  (via drill 0.6)
  Top 0.254: U1.17 11.09,39.84 10.27,40.9 7.43,40.9 v6.29,40.58
  Top 0.305: v7.45,54.17 8.23,54.17 8.23,53.85 10.64,53.84 10.67,54.47 GPS.2_TXD1
  Bottom 0.254: v6.29,40.58 3.54,40.57 3.61,53.02 3.6,54.17 v7.45,54.17
U2-TX  (via drill 0.6)
  Top 0.254: v12.24,41.89 13.06,41.89 U1.16
  Top 0.61: v11.84,57.94 11.84,56.17 GPS.3_RXD1
  Bottom 0.254: v11.84,57.94 8.54,57.94 8.54,41.69 12.24,41.69 v12.24,41.89
U3-RX  (via drill 0.6)
  Top 0.254: v5.89,29.64 9.79,29.64 12.39,32.24 12.39,33.34 U1.30
  Bottom 0.254: XB1.P$2 12.63,3.29 3.84,3.29 2.54,4.59 2.54,10.56 1.1,10.56 1.1,15.41 2.53,15.41 2.54,27.89 4.29,29.64 v5.89,29.64
U3-TX  (via drill 0.6)
  Top 0.254: v8.88,33.17 9.84,33.34 10.34,33.84 U1.29
  Bottom 0.254: XB1.P$3 18.83,5.34 18.83,5.36 18.83,7.87 19.75,7.87 19.75,7.85 19.74,12.79 19.74,13.59 18.34,14.99 15.99,14.99 14.24,16.74 11.94,16.74 8.64,19.49 v8.88,33.17
USB-5V
  Top 0.254: 28.67,19.48 R7.1 | IC2.1 11.4,15.49 10.56,15.48 9.99,16.05 9.39,16.65 5.94,16.66 5.94,15.95
  Top 0.406: 29.92,1.25 29.91,12.72 29.16,13.48 28.82,13.48 28.08,14.19 28.11,15.66 28.65,16.2 R7.1 | X1.1 19.9,8.6 20,8 17.2,5.2 15.08,5.2 13.48,2.69
  Top 0.61: 5.94,15.95 C13.2 1.3,15.94 1.27,1.38 9.01,1.38 9.04,3.77 9.07,3.74 12.43,3.74 13.48,2.69 15.17,1 29.67,1 29.92,1.25
USB-DM
  Top 0.254: R3.2 25.56,16.03
  Top 0.406: X1.2 20.8,8.64 20.76,5.58 20.87,5.33 28.23,5.29 28.28,5.42 28.28,10.72 25.56,13.41 25.56,16.03
USB-DP
  Top 0.254: 23.99,13.69 24.2,13.69 24.2,16.35 23.99,16.56 23.99,18.39 26.31,18.39 R4.2
  Top 0.406: X1.3 21.6,8.7 21.6,11.2 22.1,11.7 23.5,11.7 23.99,12.19 23.99,13.69
VCC  (via drill 0.5, 0.6)  (1 unrouted)
  Top 0.254: 9.69,31.49 7.5,31.49 C23.2 7.5,31.39 4.44,31.39 v4.44,26.19 | 9.69,31.49 10.34,31.49 10.34,32.34 U1.32 | 6.09,24.75 BAROMETER.1 | 21.19,27.6 21.19,24.29 20.49,24.29 FTDI-HEADER.3 | 25.79,40.31 C24.2 26.36,41.54 27.24,41.55 27.24,46.74 S1.2 | HIGH-G_ACC.14 HIGH-G_ACC.15 20.9,46.6 21.11,46.81 22.39,46.81 22.85,47.27 C19.2 | 24.05,46.68 23.79,46.73 S1.1 23.89,46.79 25.03,46.81 25.03,54.61 25.42,55 30.1,55 30.09,55.04 30.09,57.19 29.45,57.9 17.25,57.9 17.27,57.88 17.27,55.44 | JTAG1.1 36.91,29.85 36.91,27.59 | 36.91,27.59 28.74,27.59 28.74,27.6 C25.2 | 29.17,46.64 S1.2 | C5.2 13.84,43.61 | 13.84,43.61 C14.1 | U1.13 14.54,41.79 | 14.54,41.79 14.54,42.84 14.51,42.87 14.12,42.87 13.84,43.15 13.84,43.61 | LOW-G_ACC.3 1.49,37 1.49,38.6 LOW-G_ACC.1 | C21.2 9.24,39.2 9.24,38.84 U1.19 9.79,38.84 v8.36,38.44 | v9.66,30.69 9.69,30.74 9.69,31.49 | 14.54,41.79 v14.54,37.04 v14.53,37.03 | 36.91,27.59 37.94,27.59 40.1,29.75 40.1,44.15 37.5,46.75 28.98,46.75 S1.2
  Top 0.305: U1.64 22.51,40.31 C24.2 | C25.2 21.19,27.6 21.19,29.39 20.56,29.39 U1.48 | C16.2 2.59,32.17 LOW-G_ACC.6 1.44,34.6 1.44,37 LOW-G_ACC.3 | C19.2 23.19,47.7 23.89,47 S1.1
  Top 0.406: C22.2 4.44,23.91 v4.44,26.19 4.44,28.99 2.41,31.02 2.41,32.15 C16.2 | 16.17,55.44 16.17,54.09 C18.2 | R2.1 19.77,54.37 19.3,53.9 16.37,53.9
  Top 0.61: C2.2 14.87,6.59 | 14.87,6.59 IC1.3 12.66,8.57 v11.84,9.39 | v5.99,19.44 5.99,21 BAROMETER.4 | BAROMETER.1 4.38,24.75 C22.2 | GPS.8_VCC GPS.7_VCC_IO | 14.65,6.9 14.87,6.59 | JTAG1.1 36.89,32.1 36.89,27.64 21.23,27.64 21.23,27.65 | 36.91,29.85 v35.74,29.85 v35.74,29.86 | 16.37,53.9 C18.2
  Top 0.813: GPS.8_VCC 17.27,55.44 16.17,55.44
  Bottom 0.254: XB1.P$1 16.51,2.37 13.84,5.04 10.74,5.04 6.39,9.39 | 9.57,30.75 9.96,38.44 v8.36,38.44 12.62,38.43 v14.53,37.03 | 9.57,30.75 v9.66,30.69 | 9.57,30.75 9.51,30.69 9.51,20.65 9.76,20.4 10.81,20.4 10.91,20.5 19.3,20.5 20.49,21.69 FTDI-HEADER.3
  Bottom 0.406: v5.99,19.44 4.34,19.44 4.34,26.19 v4.44,26.19
  Bottom 0.61: v5.99,19.44 5.99,9.49 6.09,9.39 6.39,9.39 v11.84,9.39 | XB1.P$1 28.69,1.35 XB1.P$14 | v35.74,29.86 36.12,29.86 36.12,35.95 CN1.4

### Text on the board
tPlace: DorMouse | Nov12 r1 | Daniel Richman / Joe Roberts